# EAGLE design PCB_for_Car (EAGLE 7.6.0)
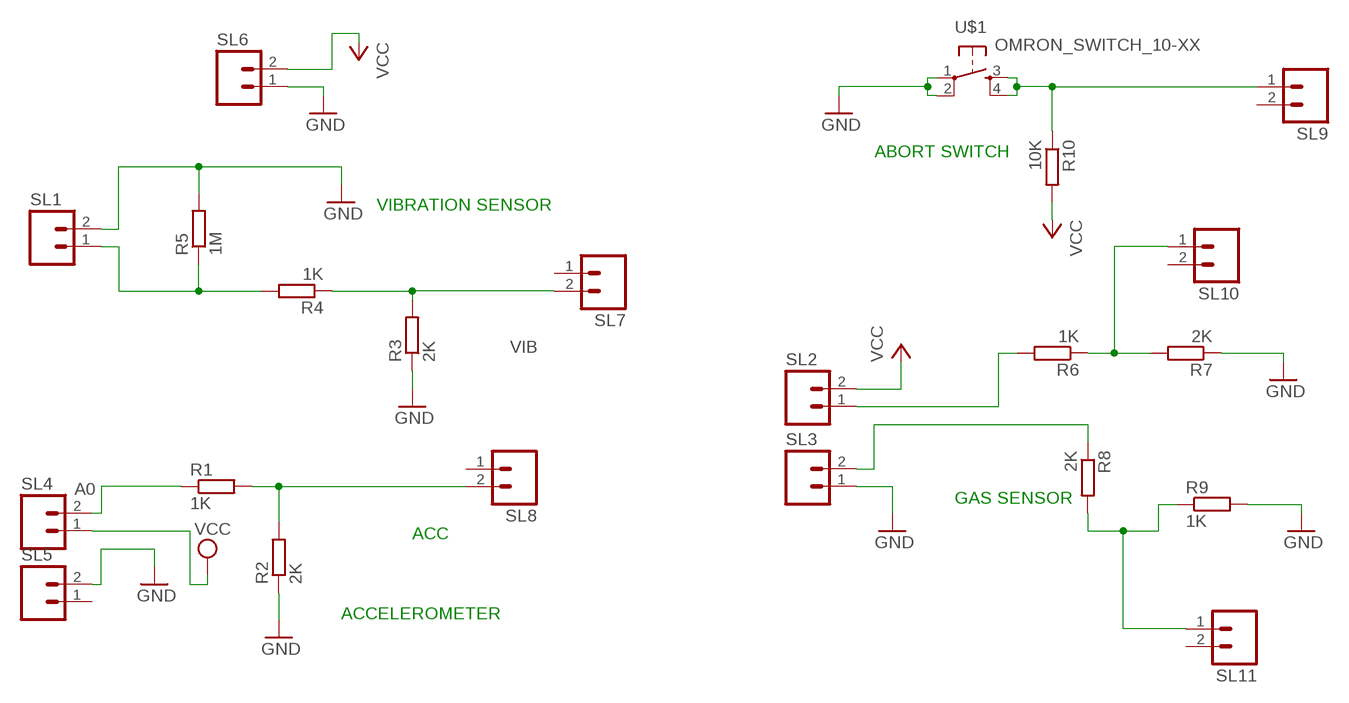
[diagram p0: schematic, sheet 1]

## Parts
R1  1K  R-EU_0204/7  [0204/7]
R2  2K  R-EU_0204/7  [0204/7]
R3  2K  R-EU_0204/7  [0204/7]
R4  1K  R-EU_0204/7  [0204/7]
R5  1M  R-EU_0204/7  [0204/7]
R6  1K  R-EU_0204/7  [0204/7]
R7  2K  R-EU_0204/7  [0204/7]
R8  2K  R-EU_0204/7  [0204/7]
R9  1K  R-EU_0204/7  [0204/7]
R10  10K  R-EU_0204/7  [0204/7]
SL1  M02  [02P]
SL2  M02  [02P]
SL3  M02  [02P]
SL4  M02  [02P]
SL5  M02  [02P]
SL6  M02  [02P]
SL7  M02  [02P]
SL8  M02  [02P]
SL9  M02  [02P]
SL10  M02  [02P]
SL11  M02  [02P]
U$1  OMRON_SWITCH_10-XX  [B3F-10XX]

## Nets
A0: R1.1 SL4.2
GND: R2.1 R3.1 R5.2 R7.1 R9.2 SL1.2 SL3.1 SL5.2 SL6.1 U$1.1(P) U$1.2(P1)
N$1: R1.2 R2.2 SL8.2
N$2: R6.2 SL2.1
N$3: R4.2 R5.1 SL1.1
N$4: R3.2 R4.1 SL7.2
N$5: R6.1 R7.2 SL10.1
N$6: R8.1 SL3.2
N$7: R8.2 R9.1 SL11.1
N$9: R10.1 SL9.1 U$1.3(S) U$1.4(S1)
VCC: R10.2 SL2.2 SL4.1 SL6.2
Unconnected: SL5.1 SL7.1 SL8.1 SL9.2 SL10.2 SL11.2

## Notes on the sheet
- ABORT SWITCH
- VIBRATION SENSOR
- VIB
- GAS SENSOR
- ACC
- ACCELEROMETER

## Library data of the parts
R1-R10 = resistor:R-EU_: RESISTOR, European symbol
SL1-SL11 = CEDT_JANUARY_2015_v5:M02: AMP QUICK CONNECTOR
U$1 = CEDT_JANUARY_2015_v5:OMRON_SWITCH

## Board
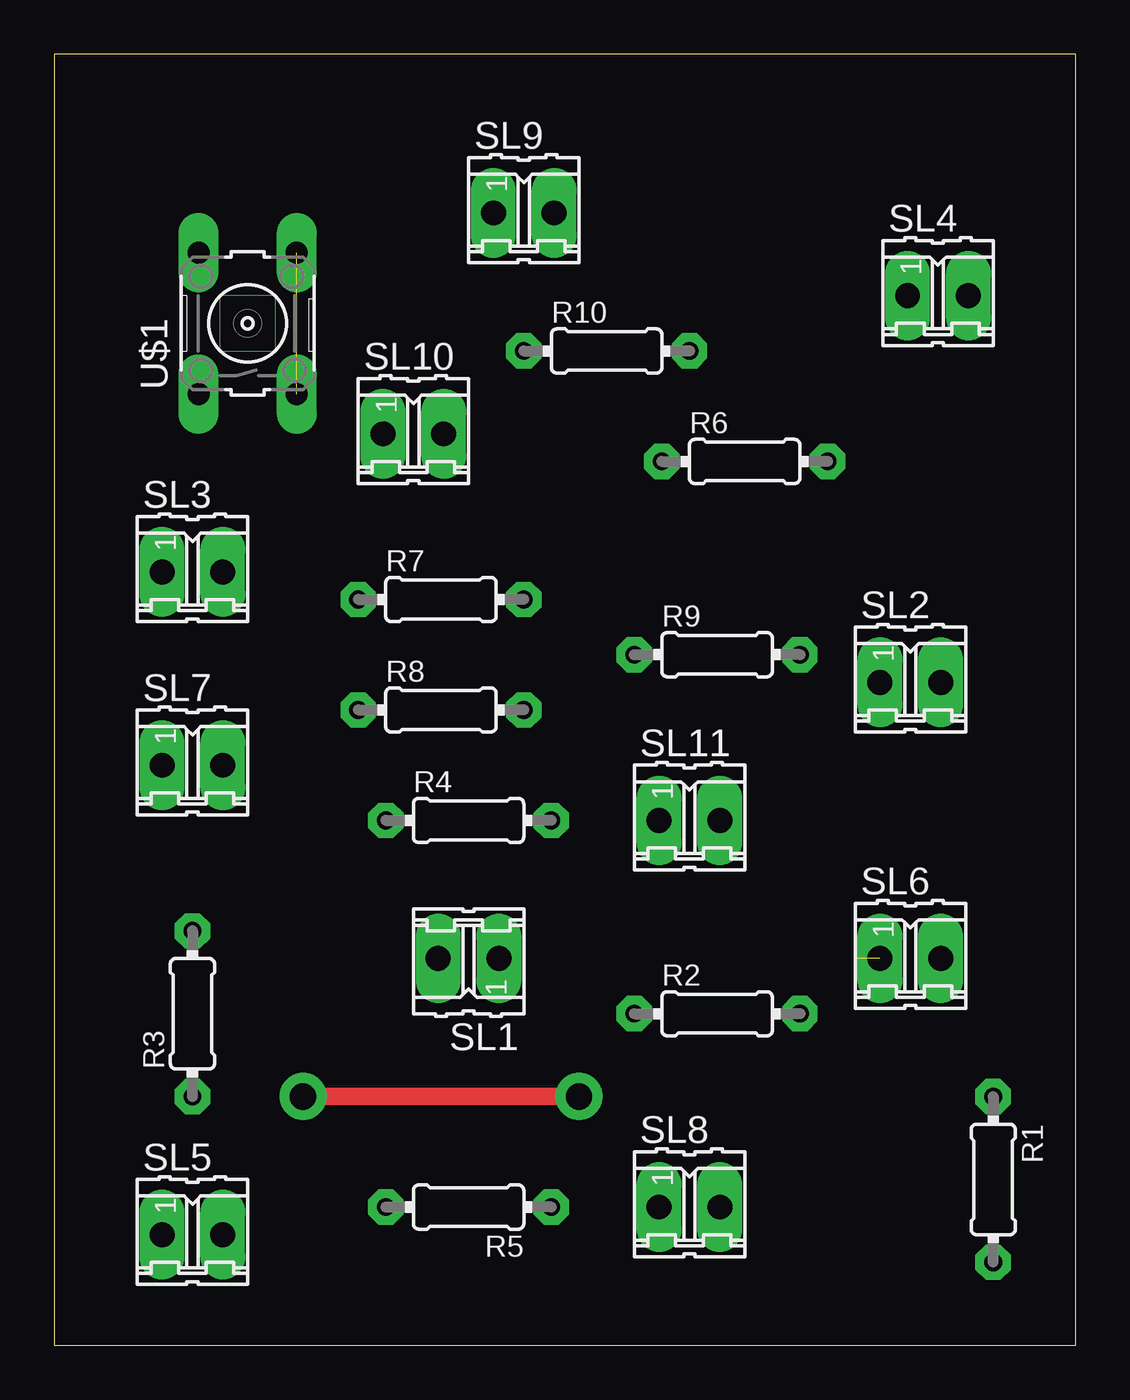
[diagram p1: board, top side]
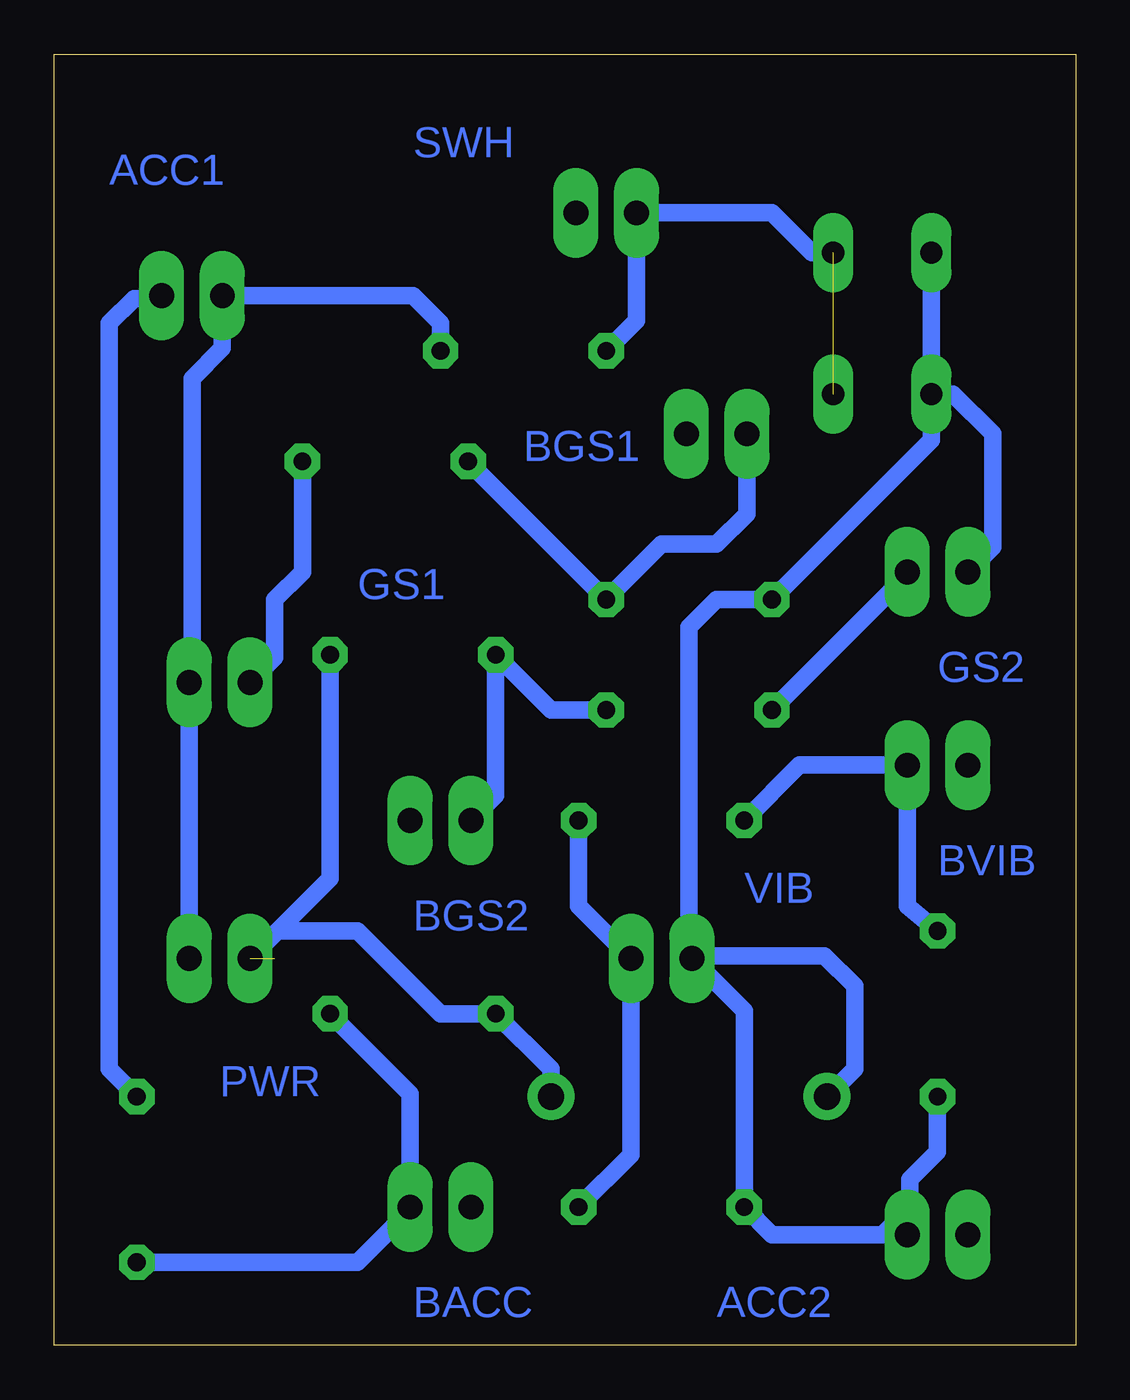
[diagram p2: board, bottom side, seen from below]

Size 46.97 x 59.36 mm. Coordinates in mm from the lower left corner, seen from the top.
Outline: 0,0 46.97,0 46.97,59.36 0,59.36 0,0
Copper layers (1*16): Top 0.035mm / dielectric 1.5mm / Bottom 0.035mm
Design rules "default *": minimum track width 16mil, minimum drill 24mil, track to track 16mil, track to pad 16mil, pad to pad 12mil, via to via 12mil, smd to smd 8mil, copper to edge 40mil, drill to drill 8mil, minimum pad ring 16mil, minimum via ring 16mil, stop-mask expansion 4mil, vias tented up to drill 0mil, thermal gap 10mil

### Footprints (pad centres in the part's own frame; a part is rotated, then mirrored left to right if it is on the bottom)
0204/7 = drill 0.813 octagon: 1 -3.81,0; 2 3.81,0
02P = drill 1.143 long: 1 -1.397,0; 2 1.397,0
B3F-10XX = drill 1.016 long: 1 -3.251,2.261; 2 3.251,2.261; 3 -3.251,-2.261; 4 3.251,-2.261

### Placement (x,y rotation side)
R1  43.18,7.62 270 top
R2  30.48,15.24 0 top
R3  6.35,15.24 90 top
R4  19.05,24.13 0 top
R5  19.05,6.35 180 top
R6  31.75,40.64 0 top
R7  17.78,34.29 0 top
R8  17.78,29.21 0 top
R9  30.48,31.75 0 top
R10  25.4,45.72 0 top
SL1  19.05,17.78 180 top
SL2  39.37,30.48 0 top
SL3  6.35,35.56 0 top
SL4  40.64,48.26 0 top
SL5  6.35,5.08 0 top
SL6  39.37,17.78 0 top
SL7  6.35,26.67 0 top
SL8  29.21,6.35 0 top
SL9  21.59,52.07 0 top
SL10  16.51,41.91 0 top
SL11  29.21,24.13 0 top
U$1  8.89,46.99 90 top

### Tracks (layer width: path | path; a pad name or v marks a point on that pad's centre or on a via)
A0
  Bottom 0.813: SL4.2 42.04,48.13 43.31,48.13 44.45,46.99 44.45,12.7 R1.1
GND  (via drill 1.2)  (1 unrouted)
  Top 0.813: v11.43,11.43 v24.13,11.43
  Bottom 0.813: U$1.1 5.64,43.74 3.81,41.91 3.81,36.7 SL3.1 | R9.2 34.29,21.46 36.7,19.05 | 36.7,19.05 SL6.1 | U$1.1 6.63,41.63 R7.1 16.51,34.29 17.78,33.02 17.78,17.91 | 17.78,17.91 SL1.2 15.24,15.37 R5.2 13.97,5.08 8.89,5.08 | SL5.2 8.89,5.08 | 36.7,19.05 33.02,19.05 29.21,15.24 R2.1 24.13,12.7 v24.13,11.43 | R3.1 6.35,8.89 7.62,7.62 7.62,6.35 8.89,5.08 | 17.78,17.91 11.56,17.91 10.16,16.51 10.16,12.7 v11.43,11.43 | U$1.2 U$1.1
N$1
  Bottom 0.813: R1.2 33.02,3.81 30.61,6.22 SL8.2 30.61,11.56 R2.2
N$2
  Bottom 0.813: R6.2 35.56,35.56 36.83,34.29 36.83,31.62 SL2.1
N$3
  Bottom 0.813: R4.2 22.86,20.19 SL1.1 20.45,8.76 R5.1
N$4
  Bottom 0.813: R3.2 7.75,20.19 SL7.2 12.7,26.67 R4.1
N$5
  Bottom 0.813: SL10.1 15.11,38.23 16.51,36.83 19.05,36.83 R7.2 R6.1
N$6
  Bottom 0.813: SL3.2 7.75,35.43 R8.1
N$7
  Bottom 0.813: R8.2 24.13,29.21 R9.1 26.67,25.27 SL11.1
N$9  (1 unrouted)
  Bottom 0.813: U$1.4 12.14,50.24 13.97,52.07 SL9.1 20.19,47.12 R10.1
VCC
  Bottom 0.813: R10.2 29.21,46.99 30.48,48.26 SL4.1 39.24,45.85 40.64,44.45 40.64,30.61 SL2.2 SL6.2

### Text on the board
Bottom: SWH | ACC1 | BGS1 | GS1 | GS2 | BVIB | VIB | BGS2 | PWR | ACC2 | BACC